# Altium schematic sheet cSLIM-SA_RS485.SchDoc: cSLIM v1 - RS485
size A4; SheetNumber: 4; SheetTotal: 12
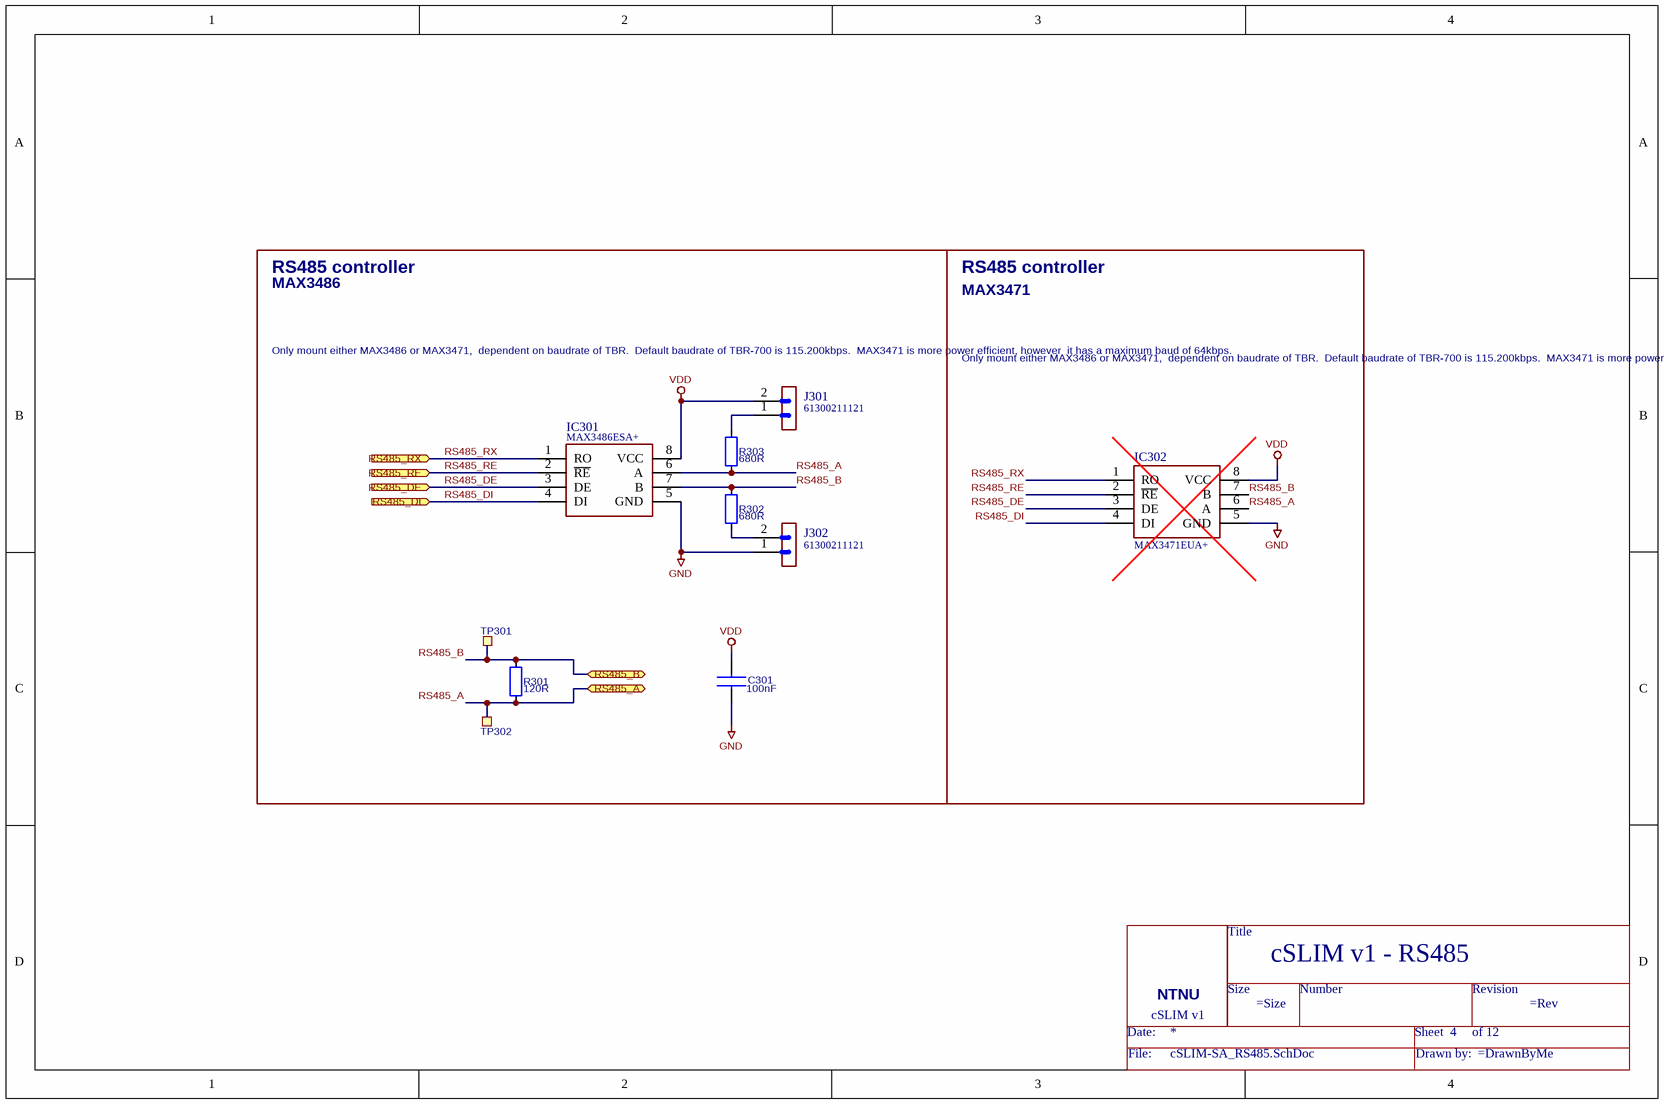
[diagram p0: cSLIM-SA_RS485.SchDoc]

## Parts
=DocumentName  Title_block  (value not drawn)  (no BOM)
C301  100nF  [CAPC1608X90N]
IC301  MAX3486ESA+  [SOIC127P600X175-8N]
IC302  MAX3471EUA+  [SOP65P490X110-8N]
J301  61300211121  [HDRV2W110P0X254_1X2_508X254X854P]
J302  61300211121  [HDRV2W110P0X254_1X2_508X254X854P]
R301  120R  [RESC1608X55N]
R302  680R  [RESC1608X55N]
R303  680R  [RESC1608X55N]
TP301  TP  [TP_SMD_Ø1.0mm]  (value not drawn)  (no BOM)
TP302  TP  [TP_SMD_Ø1.0mm]  (value not drawn)  (no BOM)

## Blocks framed on the sheet
RS485 controller: C301 IC301 J301 J302 R301-R303 TP301 TP302
RS485 controller: IC302

## Ports
RS485_A (bidir), RS485_B (bidir), RS485_DE (in), RS485_DI (in), RS485_RE (in), RS485_RX (in)

## Nets
GND: C301.2 IC301.5(GND) IC302.5(GND) J302.1
VDD: C301.1 IC301.8(VCC) IC302.8(VCC) J301.2
RS485_A: IC301.6(A) IC302.6(A) R301.2 R303.2 TP302.1 ; port RS485_A
RS485_B: IC301.7(B) IC302.7(B) R301.1 R302.1 TP301.1 ; port RS485_B
RS485_DE: IC301.3(DE) IC302.3(DE) ; port RS485_DE
RS485_DI: IC301.4(DI) IC302.4(DI) ; port RS485_DI
RS485_RE: IC301.2(~{RE}) IC302.2(~{RE}) ; port RS485_RE
RS485_RX: IC301.1(RO) IC302.1(RO) ; port RS485_RX
NetJ301_1: J301.1 R303.1
NetJ302_2: J302.2 R302.2

## Notes on the sheet
- MAX3486
- MAX3471
- (near J301) Only mount either MAX3486 or MAX3471,
  dependent on baudrate of TBR.
  Default baudrate of TBR-700 is 115.200kbps.
  MAX3471 is more power efficient, however
  it has a maximum baud of 64kbps.
- Only mount either MAX3486 or MAX3471,
  dependent on baudrate of TBR.
  Default baudrate of TBR-700 is 115.200kbps.
  MAX3471 is more power efficient, however
  it has a maximum baud of 64kbps.
- 1
- 2
- 3
- 4
- 5
- 6
- A
- B
- C
- Eivind Jølsgard
- D
- Title: cSLIM RS485
- File: cSLIM_RS485.sch
- Sheet: /
- NTNU
- KiCad E.D.A.  kicad (5.1.4)-1
- Size: A4
- Date: 2021-06-30
- Rev: v1.1
- Id: 3/11
- (in symbol Title_block) Title; Size; Number; Revision; NTNU; cSLIM v1; Date:; Sheet; of; File:; Drawn by:

## Library data of the parts
C301 = C: Capacitor; Manufacturer_Part_Number: CL10B104KB8NNNL; Fitted: Yes; value: 100nF
IC301 = MAX3486ESA+: 1/1 Transceiver Half RS422, RS485 8-SOIC; Manufacturer_Name: Maxim Integrated; Fitted: Yes; Datasheet Link: http://datasheets.maximintegrated.com/en/ds/MAX3483-MAX3491.pdf; Height: 1.75mm; Manufacturer_Part_Number: MAX3486ESA+; Mouser Part Number: 700-MAX3486ESA; Mouser Price/Stock: https://www.mouser.co.uk/ProductDetail/Maxim-Integrated/MAX3486ESA%2b?qs=1THa7WoU59FIrgcgBLF9fg%3D%3D
IC302 = MAX3471EUA+: 1/1 Transceiver Half RS422, RS485 8-uMAX-EP|8-uSOP-EP; Manufacturer_Name: Maxim Integrated; Fitted: No; Datasheet Link: http://docs-emea.rs-online.com/webdocs/0f71/0900766b80f719c9.pdf; Height: 1.1mm; Manufacturer_Part_Number: MAX3471EUA+; Mouser Part Number: 700-MAX3471EUA; Mouser Price/Stock: https://www.mouser.co.uk/ProductDetail/Maxim-Integrated/MAX3471EUA%2b?qs=1THa7WoU59GPWTW%252BBV1kJA%3D%3D
J301 J302 = 61300211121: CONN HEADER VERT 2POS 2.54MM; Manufacturer_Name: Wurth Elektronik; Fitted: Yes; Datasheet Link: https://componentsearchengine.com/Datasheets/2/61300211121.pdf; Height: 8.54mm; Manufacturer_Part_Number: 61300211121; Mouser Part Number: 710-61300211121; Mouser Price/Stock: https://www.mouser.co.uk/ProductDetail/Wurth-Elektronik/61300211121?qs=t4813l51qx%252B1A5GYDQxPlw%3D%3D
R301 = R: Manufacturer_Part_Number: RT0603DRD07120RL; Fitted: Yes; value: 120R
R302 R303 = R: Manufacturer_Part_Number: RC0603JR-07680RL; Fitted: Yes; value: 680R
TP301 TP302 = TP: Test points